# EAGLE design rapidshark-main-breakout-top-mk-1.B (EAGLE 6.5.0)
AUTHOR: sean@yak.net
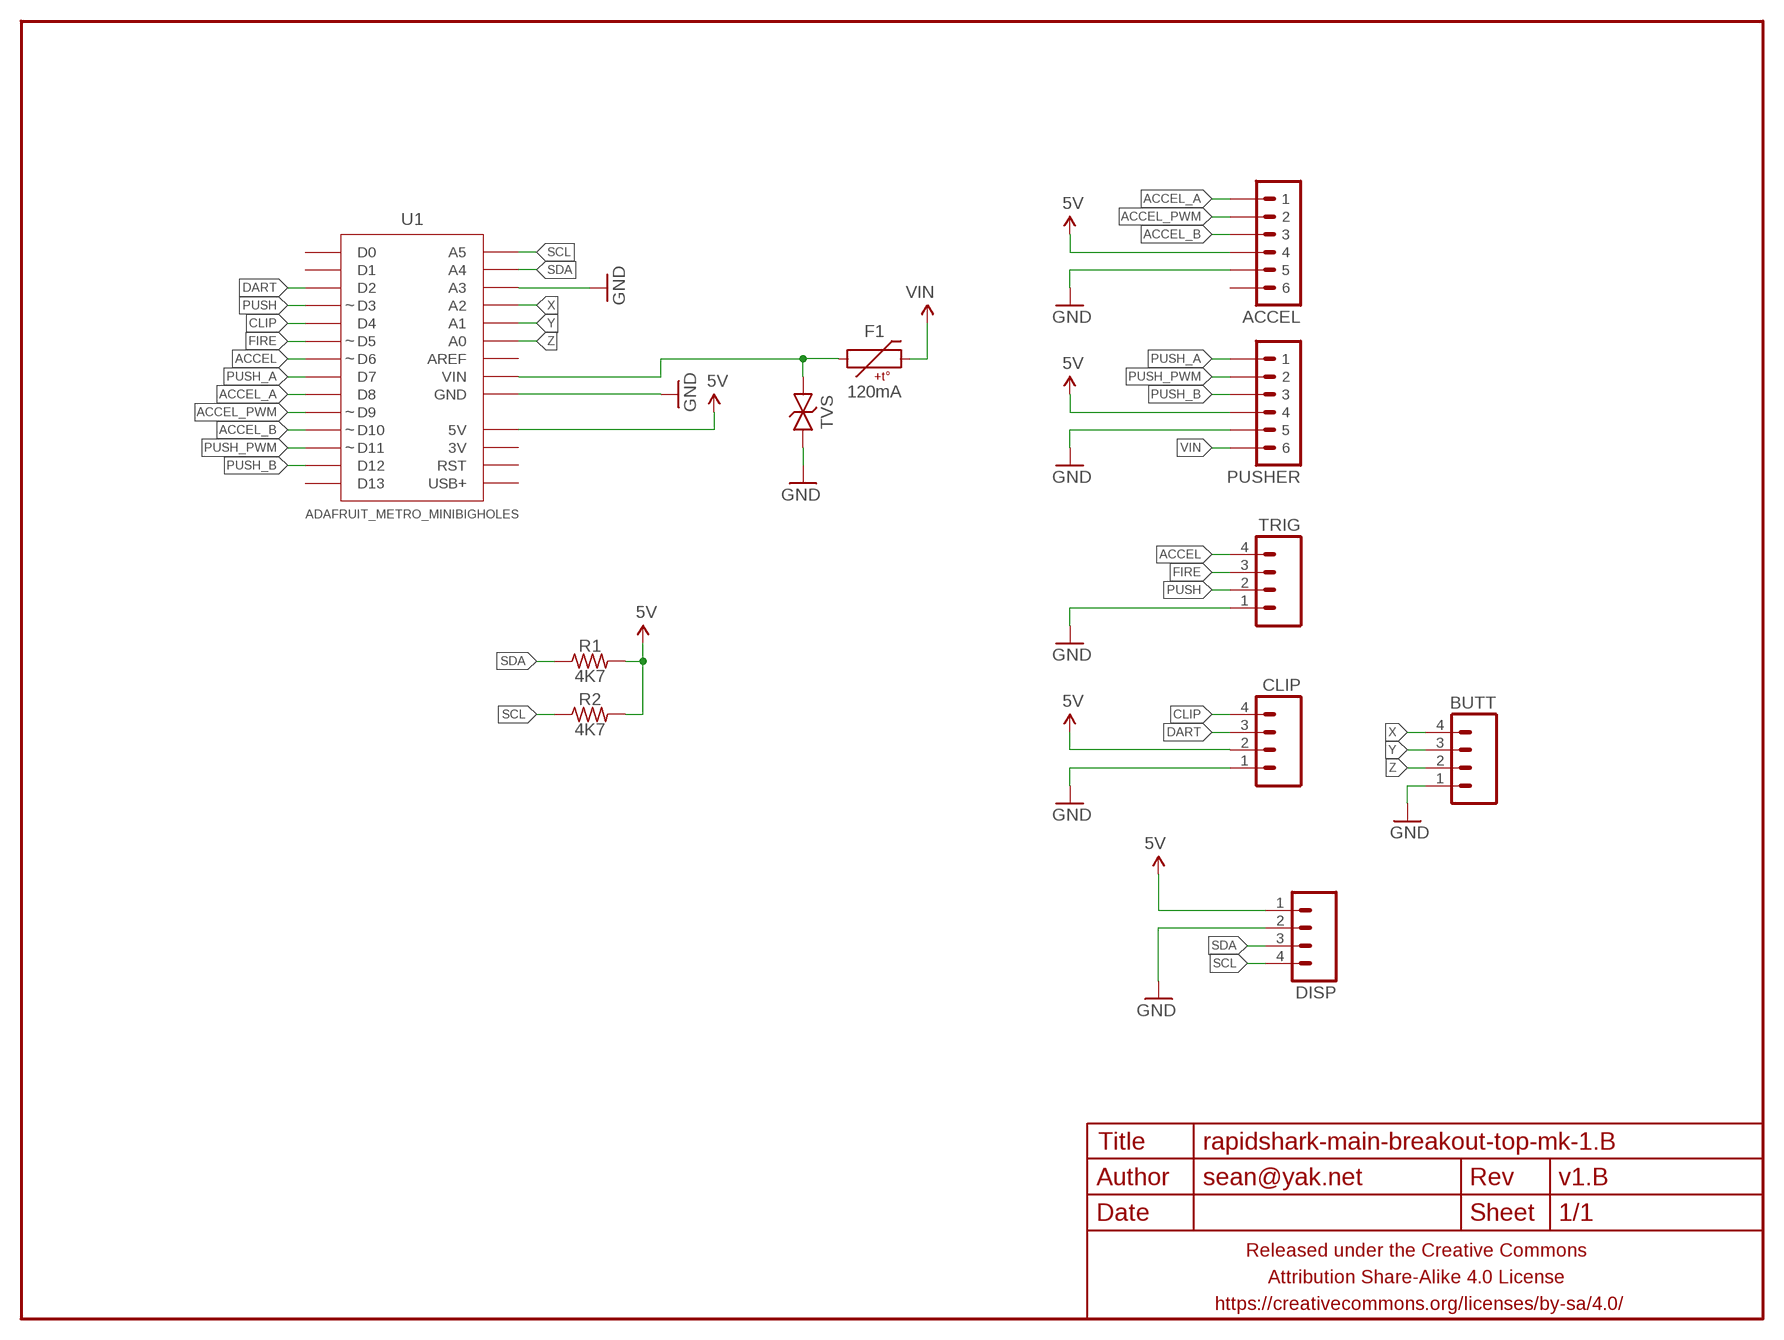
[diagram p0: schematic, sheet 1]

## Parts
ACCEL  M06JST-PH-PTH-VERT  [JST-6-PH-VERT-PTH]
BUTT  M04JST-PTH-VERT  [JST-4-PH-VERT-PTH]
CLIP  M04JST-PTH-VERT  [JST-4-PH-VERT-PTH]
DISP  M04JST-PTH-VERT  [JST-4-PH-VERT-PTH]
F1  120mA  PTCSMD  [PTC-1206]
FRAME1  FRAME-LETTERNO_PACKAGE  [DUMMY]
PUSHER  M06JST-PH-PTH-VERT  [JST-6-PH-VERT-PTH]
R1  4K7  RESISTORR0805  [R0805]
R2  4K7  RESISTORR0805  [R0805]
TRIG  M04JST-PTH-VERT  [JST-4-PH-VERT-PTH]
TVS  TVSSMA  [SMA-DIODE-TVS-BIDIR]
U1  ADAFRUIT_METRO_MINIBIGHOLES  [ADAFRUIT_METRO_MINI_BIGHOLES]

## Nets
5V: ACCEL.4 CLIP.2 DISP.1 PUSHER.4 R1.2 R2.2 U1.18(5V)
ACCEL: TRIG.4 U1.7(D6)
ACCEL_A: ACCEL.1 U1.9(D8)
ACCEL_B: ACCEL.3 U1.11(D10)
ACCEL_PWM: ACCEL.2 U1.10(D9)
CLIP: CLIP.4 U1.5(D4)
DART: CLIP.3 U1.3(D2)
FIRE: TRIG.3 U1.6(D5)
GND: ACCEL.5 BUTT.1 CLIP.1 DISP.2 PUSHER.5 TRIG.1 TVS.1 U1.19(GND) U1.20(GND) U1.26(A3)
N$1: F1.1 TVS.2 U1.21(VIN)
PUSH: TRIG.2 U1.4(D3)
PUSH_A: PUSHER.1 U1.8(D7)
PUSH_B: PUSHER.3 U1.13(D12)
PUSH_PWM: PUSHER.2 U1.12(D11)
SCL: DISP.4 R2.1 U1.28(A5)
SDA: DISP.3 R1.1 U1.27(A4)
VIN: F1.2 PUSHER.6
X: BUTT.4 U1.25(A2)
Y: BUTT.3 U1.24(A1)
Z: BUTT.2 U1.23(A0)
Unconnected: ACCEL.6 U1.1(D0) U1.2(D1) U1.14(D13) U1.15(USB+) U1.16(RST) U1.17(3V) U1.22(AREF)

## Library data of the parts
ACCEL PUSHER = A_butts:M06: Header 6 Standard 6-pin 0.1" header. Use with straight break away headers (SKU : PRT-00116), right angle break away headers (PRT-00553), swiss pins (PRT-00743), machine pins (PRT-00117), and female headers (PRT-00115). Molex polarized connector foot print use with SKU : PRT-08094 with associated crimp pins and housings. NOTES ON THE VARIANTS LOCK and LOCK_LONGPADS... This footprint was designed to help hold the alignment of a through-hole component (i.e. 6-pin header) while soldering it into place. You may notice that each hole has been shifted either up or down by 0.005 of an inch from it's more standard position (which is a perfectly straight line). This slight alteration caused the pins (the squares in the middle) to touch the edges of the holes. Because they are alternating, it causes a "brace" to hold the component in place. 0.005 has proven to be the perfect amount of "off-center" position when using our standard breakaway headers. Although looks a little odd when you look at the bare footprint, once you have a header in there, the alteration is very hard to notice. Also,if you push a header all the way into place, it is covered up entirely on the bottom side. This idea of altering the position of holes to aid alignment will be further integrated into the Sparkfun Library for other footprints. It can help hold any component with 3 or more connection pins.
BUTT CLIP DISP TRIG = A_butts:M04: Header 4 Standard 4-pin 0.1" header. Use with straight break away headers (SKU : PRT-00116), right angle break away headers (PRT-00553), swiss pins (PRT-00743), machine pins (PRT-00117), and female headers (PRT-00115). Molex polarized connector foot print use with SKU : PRT-08231 with associated crimp pins and housings. 1MM SMD Version SKU: PRT-10208
F1 = A_butts:PTC: Resettable Fuse PTC Resettable Fuse. Spark Fun Electronics SKU : COM-08357; PROD_ID: RES-11150
FRAME1 = A_butts:FRAME-LETTER: Schematic Frame Standard 8.5x11 US Letter frame; DESIGNER: sean@yak.net; VERSION: v1.B
R1 R2 = A_butts:RESISTOR: RESISTOR, American symbol
TVS = A_butts:TVS: Transient voltage suppressor- prevents ESD on inputs. Ignore package description- MBRA140 is NOT this type of part!!!
U1 = A_butts:ADAFRUIT_METRO_MINI

## Board
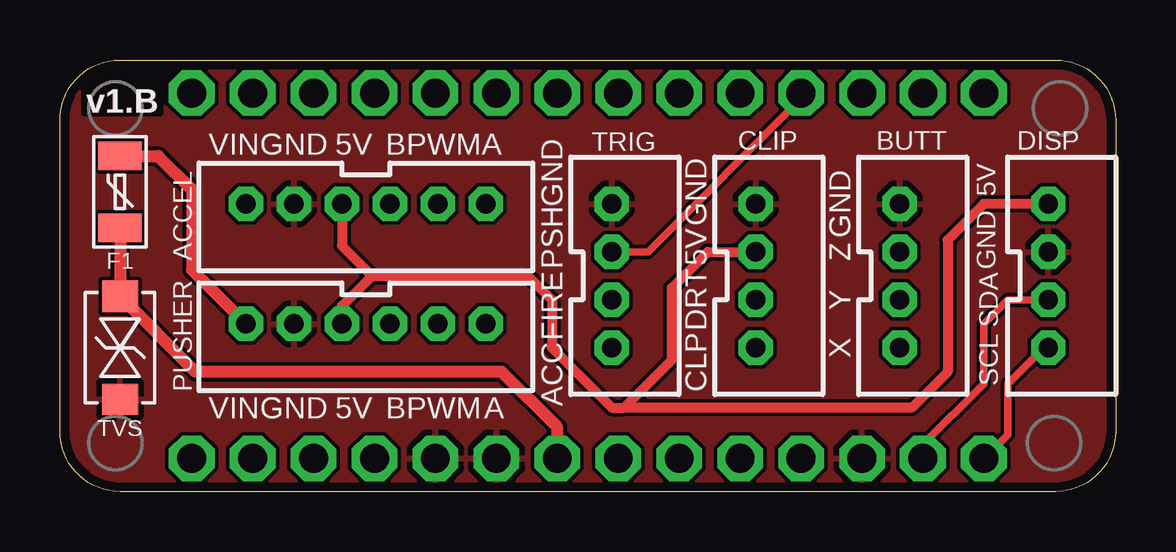
[diagram p1: board, top side]
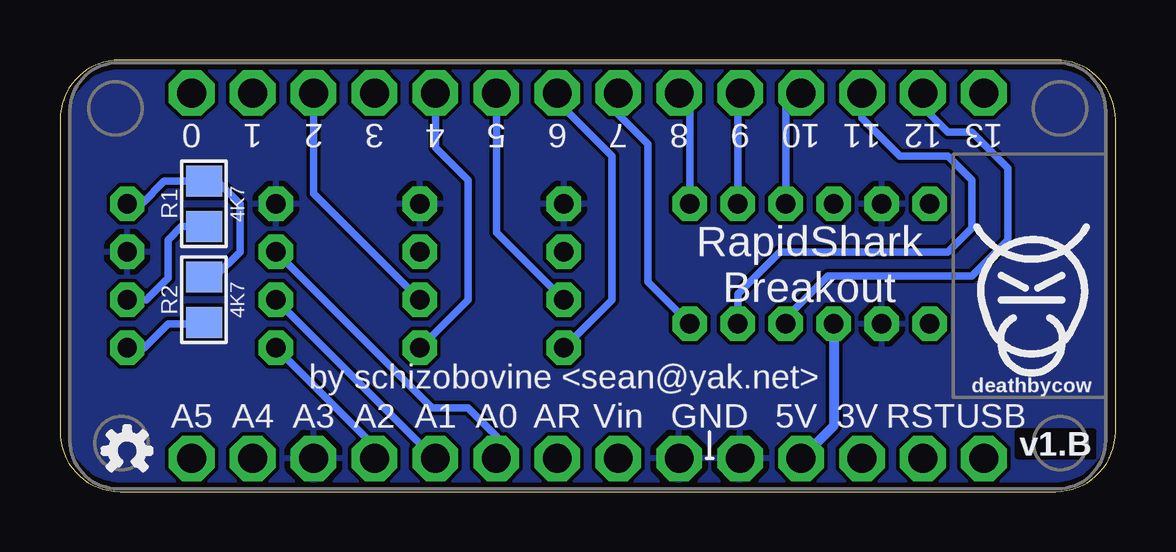
[diagram p2: board, bottom side, seen from below]

Size 44 x 18 mm. Coordinates in mm from the lower left corner, seen from the top.
Outline: 2.5,18 41.5,18 arc-90 44,15.5 44,2.5 arc-90 41.5,0 2.5,0 arc-90 0,2.5 0,15.5 arc-90 2.5,18
Copper layers (1*16): Top 0.0356mm / dielectric 1.5011mm / Bottom 0.0356mm
Design rules "LaenPCBOrder_2": minimum track width 6mil, minimum drill 13mil, track to track 6mil, track to pad 6mil, pad to pad 6mil, via to via 6mil, smd to smd 6mil, copper to edge 15mil, drill to drill 6mil, minimum pad ring 7mil, minimum via ring 7mil, stop-mask expansion 3mil, vias tented up to drill 20mil, thermal gap 10mil

### Footprints (pad centres in the part's own frame; a part is rotated, then mirrored left to right if it is on the bottom)
JST-6-PH-VERT-PTH = drill 0.8 pad 1.422 octagon: 1 -5,0; 2 -3,0; 3 -1,0; 4 1,0; 5 3,0; 6 5,0
JST-4-PH-VERT-PTH = drill 0.8 pad 1.422 octagon: 1 0,0; 2 2,0; 3 4,0; 4 6,0
PTC-1206 = smd 1.2 x 1.8: 1 -1.5,0; 2 1.5,0
R0805 = smd 1.3 x 1.5: 1 -0.95,0; 2 0.95,0
SMA-DIODE-TVS-BIDIR = smd 1.3 x 1.5: 1 -2.15,0; 2 2.15,0
ADAFRUIT_METRO_MINI_BIGHOLES = drill 1.2 pad 1.9 octagon: 1 16.51,7.62; 2 13.97,7.62; 3 11.43,7.62; 4 8.89,7.62; 5 6.35,7.62; 6 3.81,7.62; 7 1.27,7.62; 8 -1.27,7.62; 9 -3.81,7.62; 10 -6.35,7.62; 11 -8.89,7.62; 12 -11.43,7.62; 13 -13.97,7.62; 14 -16.51,7.62; 15 -16.51,-7.62; 16 -13.97,-7.62; 17 -11.43,-7.62; 18 -8.89,-7.62; 19 -6.35,-7.62; 20 -3.81,-7.62; 21 -1.27,-7.62; 22 1.27,-7.62; 23 3.81,-7.62; 24 6.35,-7.62; 25 8.89,-7.62; 26 11.43,-7.62; 27 13.97,-7.62; 28 16.51,-7.62

### Placement (x,y rotation side)
ACCEL  12.75,12 180 top
BUTT  35,12 270 top
CLIP  29,12 270 top
DISP  41.2,12 270 top
F1  2.5,12.5 90 top
FRAME1  0,0 270 bottom
PUSHER  12.75,7 180 top
R1  38,12 90 bottom
R2  38,8 90 bottom
TRIG  23,12 270 top
TVS  2.5,6 90 top
U1  22,9 0 top
U$2  [COW_SMALL]  3.5,8.5 0 bottom
U$3  [OSHWLOGO_TINY_SILKONLY]  41.2,1.7 0 bottom

### Tracks (layer width: path | path; a pad name or v marks a point on that pad's centre or on a via)
5V
  Top 0.406: PUSHER.4 11.75,7.75 13,9 | 13,9 19.5,9 20.5,8 20.5,6 23,3.5 23.5,3.5 | 23.5,3.5 25.5,5.5 25.5,8.5 27,10 CLIP.2 | ACCEL.4 11.75,10.25 13,9 | 23.5,3.5 35.5,3.5 37,5 37,10.5 38.5,12 DISP.1
  Bottom 0.305: R2.2 37.55,8.95 36.5,10 36.5,12 37.45,12.95 R1.2 39.65,12.95 40.6,12 DISP.1
  Bottom 0.406: PUSHER.4 11.75,2.74 U1.18
ACCEL
  Bottom 0.305: TRIG.4 21,8 21,14 23.27,16.27 U1.7
ACCEL_A
  Bottom 0.305: U1.9 17.75,16.18 ACCEL.1
ACCEL_B
  Bottom 0.305: U1.11 13.75,15.98 ACCEL.3
ACCEL_PWM
  Bottom 0.305: U1.10 15.75,16.52 ACCEL.2
CLIP
  Bottom 0.305: CLIP.4 27,8 27,13 28.35,14.35 U1.5
DART
  Bottom 0.305: CLIP.3 33.43,12.43 U1.3
FIRE
  Bottom 0.305: TRIG.3 25.81,10.81 U1.6
GND
  pour Top (rank 6): 2.5,18 41.5,18 arc-90 44,15.5 44,2.5 arc-90 41.5,0 2.5,0 arc-90 0,2.5 0,15.5 arc-90
  pour Bottom (rank 6): 2.5,18 41.5,18 arc-90 44,15.5 44,2.5 arc-90 41.5,0 2.5,0 arc-90 0,2.5 0,15.5 arc-90
N$1
  Top 0.508: U1.21 20.73,2.67 18.4,5 5.65,5 TVS.2 F1.1
PUSH
  Top 0.305: U1.4 30.89,16.39 24.5,10 TRIG.2
PUSH_A
  Bottom 0.305: PUSHER.1 19.5,8.75 19.5,14.5 20.73,15.73 U1.8
PUSH_B
  Bottom 0.305: PUSHER.3 13.75,7.25 12,9 6,9 4.5,10.5 4.5,13.5 6,15 7,15 8.03,16.03 U1.13
PUSH_PWM
  Bottom 0.305: PUSHER.2 15.75,8.25 14,10 7,10 6,11 6,13 7,14 9,14 10.57,15.57 U1.12
SCL
  Top 0.305: U1.28 39.5,2.37 39.5,4.5 41,6 DISP.4
  Bottom 0.305: R2.1 38.05,7 39.5,7 40.5,6 DISP.4
SDA
  Top 0.305: U1.27 35.97,1.97 38.5,4.5 38.5,7 39.5,8 DISP.3
  Bottom 0.305: R1.1 38.95,11.05 39.5,10.5 39.5,8.9 40.4,8 DISP.3
VIN
  Top 0.508: F1.2 4.1,14 5.5,12.6 5.5,9.25 PUSHER.6
X
  Bottom 0.305: U1.25 30.89,1.89 BUTT.4
Y
  Bottom 0.305: U1.24 28.38,1.38 BUTT.3
Z
  Bottom 0.305: BUTT.2 28.5,3.5 27,3.5 25.81,2.31 U1.23

### Text on the board
tPlace: VIN | GND | 5V | B | PWM | A | GND | 5V | GND | GND | PSH | 5V | Z | GND | FIRE | DRT | Y | SDA | X | SCL | ACC | CLP | VIN | GND | 5V | B | PWM | A
bPlace: RapidShark / Breakout | by schizobovine <sean@yak.net>